# Altium schematic sheet FIX.schdoc
size A
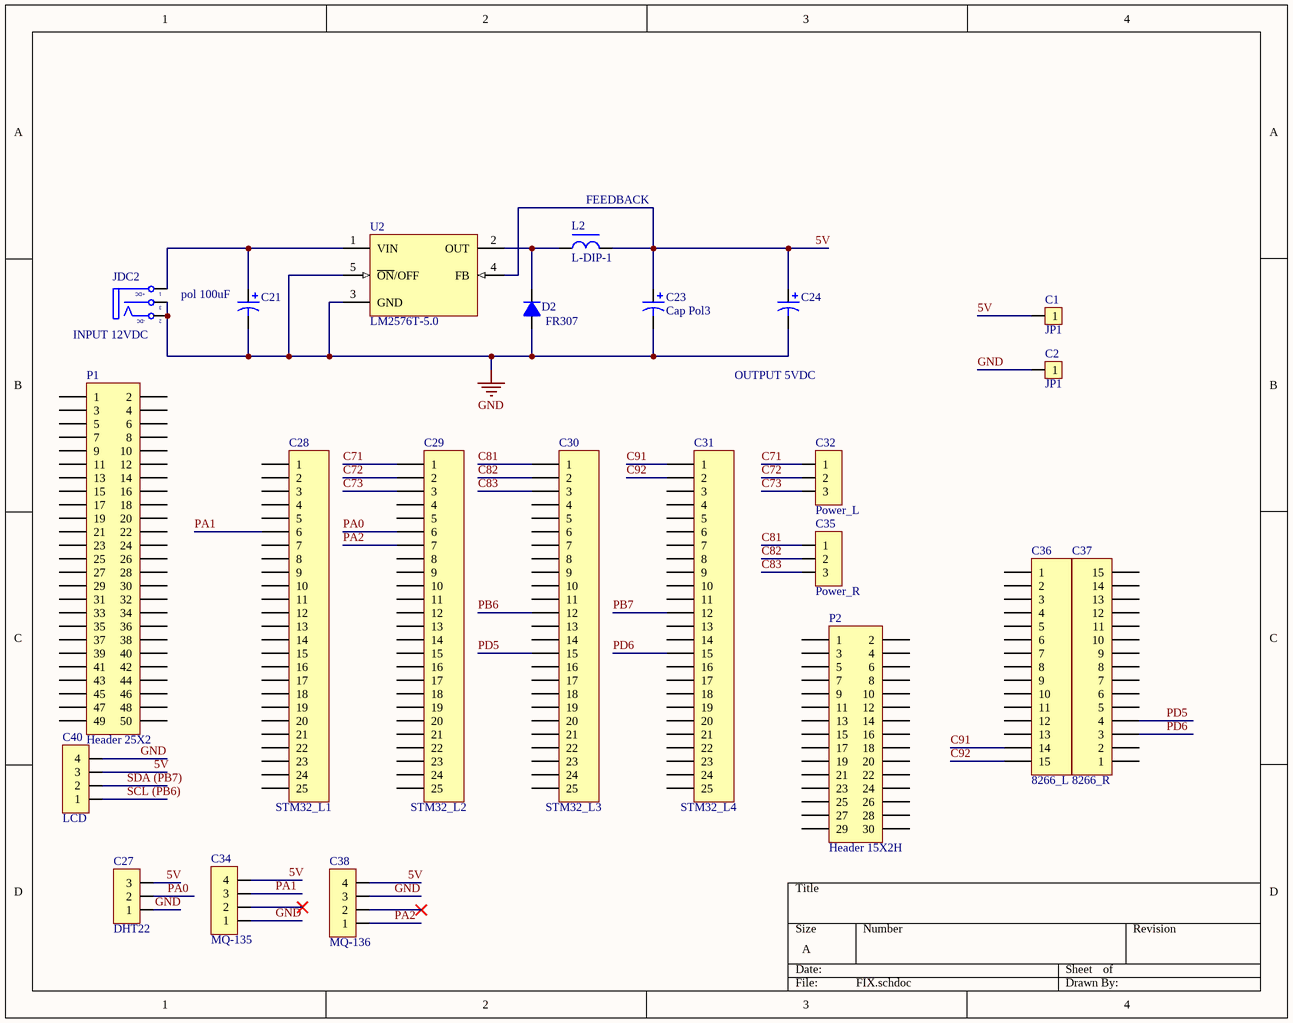
[diagram p0: FIX.schdoc]

## Parts
C1  JP1  [JP1-D1T]
C2  JP1  [JP1-D1T]
C21  pol 100uF  [C10mm]
C23  Cap Pol3  [CP2/5]
C24  (no value)  [C10mm]
C27  DHT22  [JP3-C1T]
C28  STM32_L1  [JP25-C1T]
C29  STM32_L2  [JP25-C1T]
C30  STM32_L3  [JP25-C1T]
C31  STM32_L4  [JP25-C1T]
C32  Power_L  [JP3-C1T]
C34  MQ-135  [JP4-C1T]
C35  Power_R  [JP3-C1T]
C36  8266_L  [JP15-C1T]
C37  8266_R  [JP15-C1T]
C38  MQ-136  [JP4-C1T]
C40  LCD  [JP4-C1T]
D2  FR307  [D2A]
JDC2  (no value)  [DC-IN]
L2  L-DIP-1  [L-DIP-M-5.3]
P1  Header 25X2  [HDR2X25]
P2  Header 15X2H  [HDR2X15H]
U2  LM2576T-5.0  [LM2576t]

## Nets
GND: C2.1 C21.2 C23.2 C24.2 C27.1 C34.1 C38.3 C40.4 D2.1(A) JDC2.2(TN) JDC2.3(S) U2.3(GND) U2.5(~{ON}/OFF)
5V: C1.1 C23.1 C24.1 C27.3 C34.4 C38.4 C40.3 L2.2 U2.4(FB)
C71: C29.1 C32.1
C72: C29.2 C32.2
C73: C29.3 C32.3
C81: C30.1 C35.1
C82: C30.2 C35.2
C83: C30.3 C35.3
C91: C31.1 C36.14
C92: C31.2 C36.15
PA0: C27.2 C29.6
PA1: C28.6 C34.3
PA2: C29.7 C38.1
PB6: C30.12
PB7: C31.12
PD5: C30.15 C37.4
PD6: C31.15 C37.3
SCL (PB6): C40.1
SDA (PB7): C40.2
NetC21_1: C21.1 JDC2.1(T) U2.1(VIN)
NetD2_2: D2.2(K) L2.1 U2.2(OUT)

Not connected (* = marked no-connect by the designer): C28 1 2 3 4 5 7 8 9 10 11 12 13 14 15 16 17 18 19 20 21 22 23 24 25; C29 4 5 8 9 10 11 12 13 14 15 16 17 18 19 20 21 22 23 24 25; C30 4 5 6 7 8 9 10 11 13 14 16 17 18 19 20 21 22 23 24 25; C31 3 4 5 6 7 8 9 10 11 13 14 16 17 18 19 20 21 22 23 24 25; C34 2*; C36 1 2 3 4 5 6 7 8 9 10 11 12 13; C37 1 2 5 6 7 8 9 10 11 12 13 14 15; C38 2*; P1 1 2 3 4 5 6 7 8 9 10 11 12 13 14 15 16 17 18 19 20 21 22 23 24 25 26 27 28 29 30 31 32 33 34 35 36 37 38 39 40 41 42 43 44 45 46 47 48 49 50; P2 1 2 3 4 5 6 7 8 9 10 11 12 13 14 15 16 17 18 19 20 21 22 23 24 25 26 27 28 29 30

## Notes on the sheet
- (near L2) FEEDBACK
- (near JDC2) INPUT 12VDC
- OUTPUT 5VDC
- (in symbol DCIN) +DC; -DC

## Library data of the parts
C1 C2 = JP1: WR-PHD 2.54 mm Angled Socket Header; Manufacturer: W¨¹rth Elektronik eiSos GmbH; partNo: 613002143121; ComponentLink1 Description: Manufacturer; ComponentLink2 Description: Datasheet; NoPins: 02; Created Date: 29 March 2013; ComponentLink1URL: http://www.we-online.com; ComponentLink2URL: http://katalog.we-online.de/em/datasheet/6130xx143121.pdf; Created by: Karrer Zheng
C21 C24 = Cap Pol 12mm: Polarized Capacitor (Axial); Published: 8-Jun-2000; LatestRevisionDate: 17-Jul-2002; LatestRevisionNote: Re-released for DXP Platform.; PackageReference: POLAR0.8; Publisher: Altium Limited
C23 = Cap Pol3: Polarized Capacitor (Surface Mount); VALUE: C?; LatestRevisionDate: 17-Jul-2002; LatestRevisionNote: Re-released for DXP Platform.; PackageReference: C0805; Publisher: Altium Limited
C27 C32 C35 = JP3: WR-PHD 2.54 mm Angled Socket Header; Manufacturer: W¨¹rth Elektronik eiSos GmbH; partNo: 613003143121; ComponentLink1 Description: Manufacturer; ComponentLink2 Description: Datasheet; NoPins: 03; Created Date: 29 March 2013; ComponentLink1URL: http://www.we-online.com; ComponentLink2URL: http://katalog.we-online.de/em/datasheet/6130xx143121.pdf; Created by: Karrer Zheng
C28-C31 = JP25: WR-PHD 2.54 mm Angled Socket Header; Manufacturer: W¨¹rth Elektronik eiSos GmbH; partNo: 613025143121; ComponentLink1 Description: Manufacturer; ComponentLink2 Description: Datasheet; NoPins: 25; Created Date: 29 March 2013; ComponentLink1URL: http://www.we-online.com; ComponentLink2URL: http://katalog.we-online.de/em/datasheet/6130xx143121.pdf; Created by: Karrer Zheng
C34 C38 C40 = JP4: WR-PHD 2.54 mm Angled Socket Header; Manufacturer: W¨¹rth Elektronik eiSos GmbH; partNo: 613004143121; ComponentLink1 Description: Manufacturer; ComponentLink2 Description: Datasheet; NoPins: 04; Created Date: 29 March 2013; ComponentLink1URL: http://www.we-online.com; ComponentLink2URL: http://katalog.we-online.de/em/datasheet/6130xx143121.pdf; Created by: Karrer Zheng
C36 C37 = JP15: WR-PHD 2.54 mm Angled Socket Header; Manufacturer: W¨¹rth Elektronik eiSos GmbH; partNo: 613015143121; ComponentLink1 Description: Manufacturer; ComponentLink2 Description: Datasheet; NoPins: 15; Created Date: 29 March 2013; ComponentLink1URL: http://www.we-online.com; ComponentLink2URL: http://katalog.we-online.de/em/datasheet/6130xx143121.pdf; Created by: Karrer Zheng
D2 = D1A: Diode 1A; Value: 1N4007
JDC2 = DCIN: Jac DC input; Value: Jac DC
L2 = L-DIP-1: Inductor; Value: 150 mH
P1 = Header 25X2: Header, 25-Pin, Dual row; LatestRevisionDate: 17-Jul-2002; LatestRevisionNote: Re-released for DXP Platform.; Publisher: Altium Limited
P2 = Header 15X2H: Header, 15-Pin, Dual row, Right Angle; LatestRevisionDate: 17-Jul-2002; LatestRevisionNote: Re-released for DXP Platform.; Publisher: Altium Limited
U2 = LM2576T-5.0: SIMPLE SWITCHER; 3A Step-Down Voltage Regulator; Manufacturer: National Semiconductor; PackageTopMarking: NSUZXYTT*LM2576T*-5.0 P+; PowerWise: N; FirstPublished: 4-Dec-2008; DatasheetVersion: Aug-2004; PackageVersion: revJ, Jan-1992; PackageReference: T05A; Publisher: Altium Limited; PackageDescription: TO-220, Molded, 5 Lead, Straight; CompType: Switcher; PartNumber: LM2576T-5.0; RoHS: O; PinCount: 5; DigiKeyPartNumber: LM2576T-5.0-ND; Code_JEDEC: TO-220-AB; ComponentLink1Description: LM2576 Datasheet; ComponentLink1URL: http://www.national.com/ds/LM/LM2576.pdf; ComponentLink2Description: LM2576 Web Page; ComponentLink2URL: http://www.national.com/pf/LM/LM2576.html; ComponentLink3Description: T05A Package Page; ComponentLink3URL: http://www.national.com/packaging/folders/t05a.html